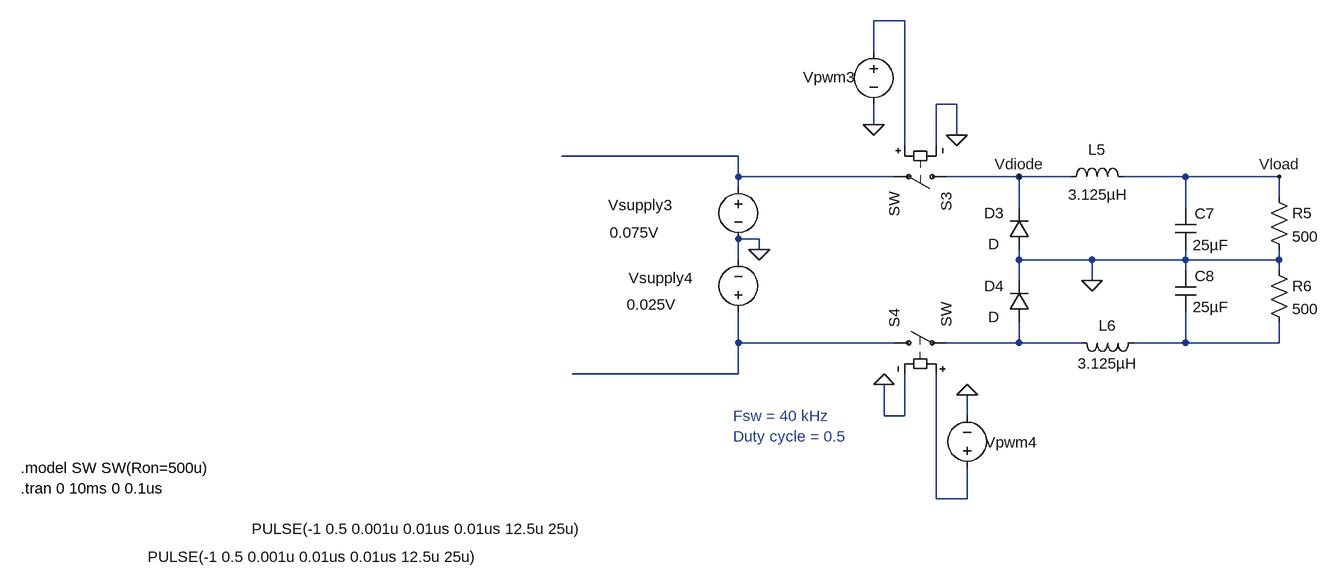
[diagram p0: schematic AC Power Flow ver2.5 (CM-DM Model Appl2) .asc]
AC Power Flow ver2.5 (CM-DM Model Appl2) .asc, the LTspice schematic file:
Version 4
SHEET 1 3264 1352
WIRE 1456 -304 1408 -304
WIRE 1408 -256 1408 -304
WIRE 1536 -176 1504 -176
WIRE 1408 -144 1408 -176
WIRE 1536 -128 1536 -176
WIRE 1456 -112 1456 -304
WIRE 1504 -112 1504 -176
WIRE 1200 -96 928 -96
WIRE 1200 -64 1200 -96
WIRE 1440 -64 1200 -64
WIRE 1632 -64 1520 -64
WIRE 1712 -64 1632 -64
WIRE 1888 -64 1792 -64
WIRE 2032 -64 1888 -64
WIRE 1200 -48 1200 -64
WIRE 2032 -32 2032 -64
WIRE 1632 -16 1632 -64
WIRE 1888 -16 1888 -64
WIRE 1232 32 1200 32
WIRE 1232 48 1232 32
WIRE 1200 64 1200 32
WIRE 1632 64 1632 48
WIRE 1744 64 1632 64
WIRE 1888 64 1888 48
WIRE 1888 64 1744 64
WIRE 2032 64 2032 48
WIRE 2032 64 1888 64
WIRE 1888 80 1888 64
WIRE 2032 80 2032 64
WIRE 1632 96 1632 64
WIRE 1744 96 1744 64
WIRE 1200 192 1200 144
WIRE 1440 192 1200 192
WIRE 1632 192 1632 160
WIRE 1632 192 1520 192
WIRE 1728 192 1632 192
WIRE 1888 192 1888 144
WIRE 1888 192 1808 192
WIRE 2032 192 2032 160
WIRE 2032 192 1888 192
WIRE 1200 240 1200 192
WIRE 1200 240 944 240
WIRE 1424 304 1424 256
WIRE 1456 304 1456 240
WIRE 1456 304 1424 304
WIRE 1552 304 1552 272
WIRE 1504 432 1504 240
WIRE 1552 432 1552 384
WIRE 1552 432 1504 432
FLAG 1536 -128 0
FLAG 2032 -64 Vload
FLAG 1408 -144 0
FLAG 1632 -64 Vdiode
FLAG 1424 256 0
FLAG 1552 272 0
FLAG 1744 96 0
FLAG 1232 48 0
SYMBOL sw 1536 -64 R90
SYMATTR InstName S3
SYMBOL res 2016 -48 R0
SYMATTR InstName R5
SYMATTR Value 500
SYMBOL diode 1648 48 R180
WINDOW 0 39 56 Left 2
WINDOW 3 46 8 Left 2
SYMATTR InstName D3
SYMBOL ind 1696 -48 R270
WINDOW 0 42 56 VTop 2
WINDOW 3 4 57 VBottom 2
SYMATTR InstName L5
SYMATTR Value 3.125µH
SYMBOL cap 1872 -16 R0
WINDOW 0 30 9 Left 2
WINDOW 3 27 57 Left 2
SYMATTR InstName C7
SYMATTR Value 25µF
SYMBOL voltage 1408 -272 R0
WINDOW 3 -445 750 Right 2
WINDOW 123 0 0 Left 2
WINDOW 39 0 0 Left 2
WINDOW 0 -108 55 Left 2
SYMATTR Value PULSE(-1 0.5 0.001u 0.01us 0.01us 12.5u 25u)
SYMATTR InstName Vpwm3
SYMBOL ind 1824 176 R90
WINDOW 0 5 56 VBottom 2
WINDOW 3 32 56 VTop 2
SYMATTR InstName L6
SYMATTR Value 3.125µH
SYMBOL cap 1872 80 R0
WINDOW 0 30 9 Left 2
WINDOW 3 27 57 Left 2
SYMATTR InstName C8
SYMATTR Value 25µF
SYMBOL res 2016 64 R0
SYMATTR InstName R6
SYMATTR Value 500
SYMBOL diode 1648 160 R180
WINDOW 0 39 56 Left 2
WINDOW 3 46 8 Left 2
SYMATTR InstName D4
SYMBOL sw 1424 192 R270
SYMATTR InstName S4
SYMBOL voltage 1552 400 R180
WINDOW 3 1261 -121 Right 2
WINDOW 123 0 0 Left 2
WINDOW 39 0 0 Left 2
WINDOW 0 -108 55 Left 2
SYMATTR Value PULSE(-1 0.5 0.001u 0.01us 0.01us 12.5u 25u)
SYMATTR InstName Vpwm4
SYMBOL voltage 1200 -64 R0
WINDOW 3 -198 86 Left 2
WINDOW 123 0 0 Left 2
WINDOW 39 0 0 Left 2
WINDOW 0 -200 44 Left 2
SYMATTR Value 0.075V
SYMATTR InstName Vsupply3
SYMBOL voltage 1200 160 R180
WINDOW 3 95 27 Left 2
WINDOW 123 0 0 Left 2
WINDOW 39 0 0 Left 2
WINDOW 0 70 68 Left 2
SYMATTR Value 0.025V
SYMATTR InstName Vsupply4
TEXT 96 416 Left 2 !.tran 0 10ms 0 0.1us
TEXT 96 384 Left 2 !.model SW SW(Ron=500u)
TEXT 1192 304 Left 2 ;Fsw = 40 kHz
TEXT 1192 336 Left 2 ;Duty cycle = 0.5

The netlist it stands for:
* AC Power Flow ver2.5 (CM-DM Model Appl2) .asc
S3 Vdiode N002 N001 0 SW
R5 Vload 0 500
D3 0 Vdiode D
L5 Vdiode Vload 3.125µH
C7 Vload 0 25µF
Vpwm3 N001 0 PULSE(-1 0.5 0.001u 0.01us 0.01us 12.5u 25u)
L6 N005 N004 3.125µH
C8 0 N005 25µF
R6 0 N005 500
D4 N004 0 D
S4 N003 N004 N006 0 SW
Vpwm4 N006 0 PULSE(-1 0.5 0.001u 0.01us 0.01us 12.5u 25u)
Vsupply3 N002 0 0.075V
Vsupply4 N003 0 0.025V
.model D D
.lib standard.dio
.tran 0 10ms 0 0.1us
.model SW SW(Ron=500u)
* Fsw = 40 kHz
* Duty cycle = 0.5
.backanno
.end